# Altium project baseboard.PrjPcb
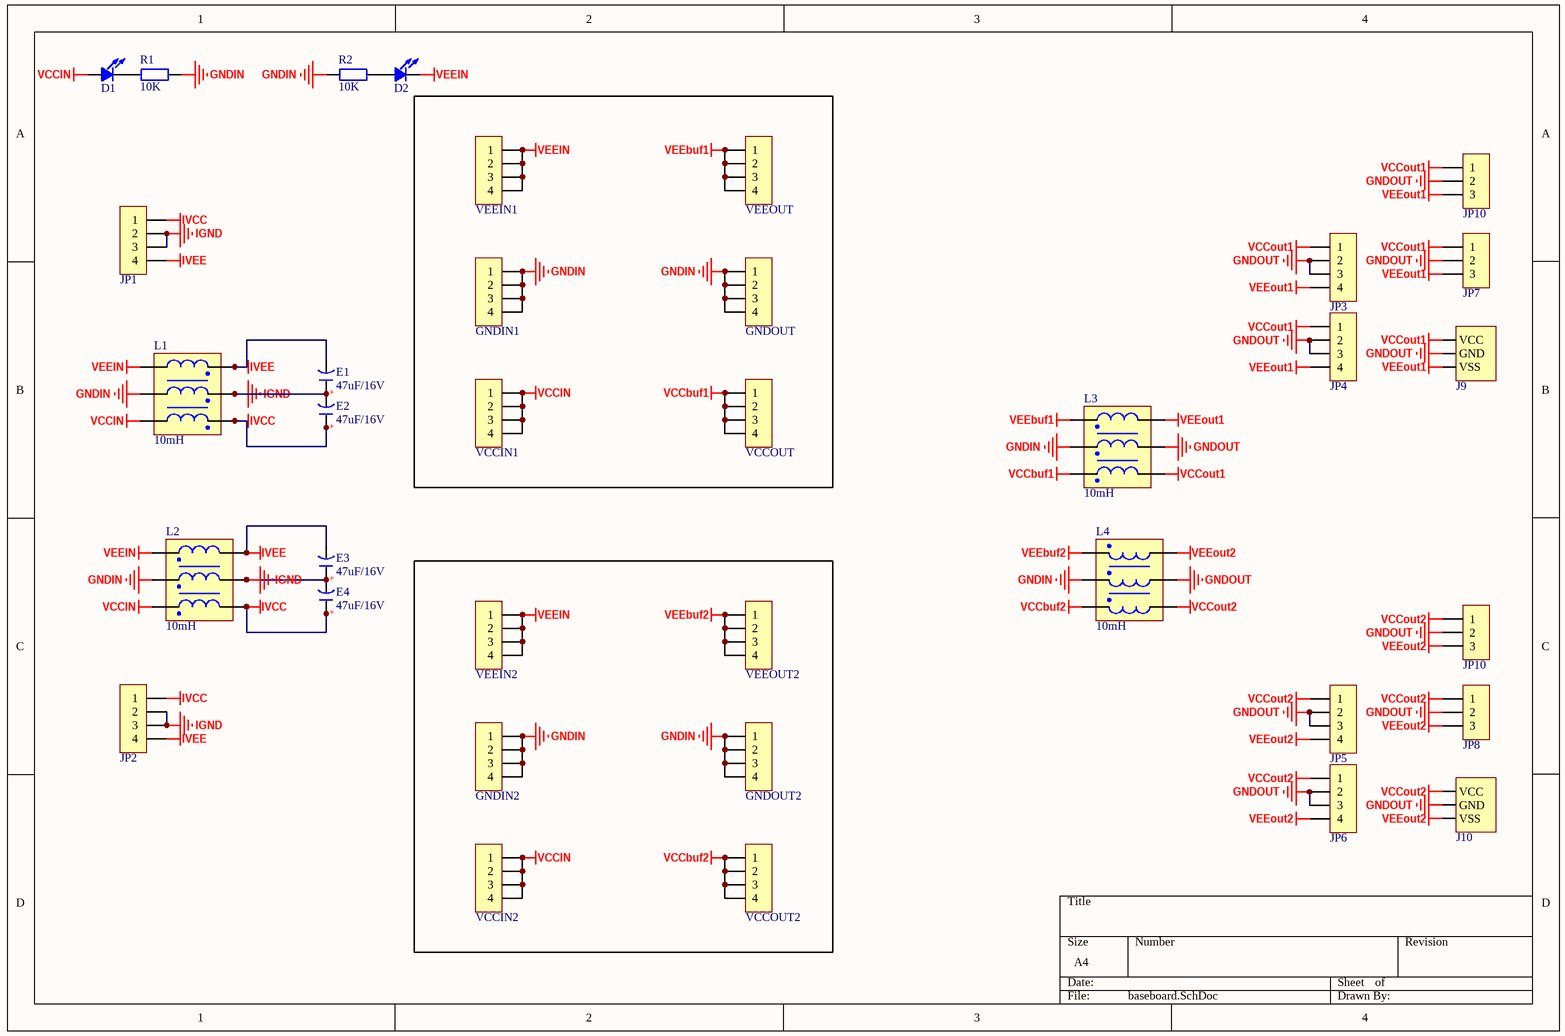
[diagram p0: baseboard.SchDoc]
1 sheet, 36 parts. Net scope: global (net labels, ports and power ports of the same name join across sheets).
Board file: baseboard.PcbDoc

## Sheet baseboard.SchDoc
size A4

### Parts
(Parts that share a designator on the sheet are numbered #1, #2 ... from top to bottom, then left to right.)
D1  LED  [Led-0805_L]  (value not drawn)
D2  LED  [Led-0805_L]  (value not drawn)
E1  47uF/16V  [CAP 2.5*6.3*7]
E2  47uF/16V  [CAP 2.5*6.3*7]
E3  47uF/16V  [CAP 2.5*6.3*7]
E4  47uF/16V  [CAP 2.5*6.3*7]
GNDIN1  HDR-1X4  [HDR2.54-LI-4P]  (value not drawn)
GNDIN2  HDR-1X4  [HDR2.54-LI-4P]  (value not drawn)
GNDOUT  HDR-1X4  [HDR2.54-LI-4P]  (value not drawn)
GNDOUT2  HDR-1X4  [HDR2.54-LI-4P]  (value not drawn)
J9  接线座-3P  [KF128-5.08-3P]  (value not drawn)
J10  接线座-3P  [KF128-5.08-3P]  (value not drawn)
JP1  HDR-1X4  [VH3.96-LI-4P]  (value not drawn)
JP2  HDR-1X4  [VH3.96-LI-4P]  (value not drawn)
JP3  HDR-1X4  [VH3.96-LI-4P]  (value not drawn)
JP4  HDR-1X4  [VH3.96-LI-4P]  (value not drawn)
JP5  HDR-1X4  [VH3.96-LI-4P]  (value not drawn)
JP6  HDR-1X4  [VH3.96-LI-4P]  (value not drawn)
JP7  HDR-1X3  [XH2.54-LI-3P]  (value not drawn)
JP8  HDR-1X3  [XH2.54-LI-3P]  (value not drawn)
JP10#1  HDR-1X3  [XH2.54-LI-3P]  (value not drawn)
JP10#2  HDR-1X3  [XH2.54-LI-3P]  (value not drawn)
L1  10mH  [Inductor CM 3phase-1]
L2  10mH  [Inductor CM 3phase-1]
L3  10mH  [Inductor CM 3phase-1]
L4  10mH  [Inductor CM 3phase-1]
R1  10K  [R 0603_L]
R2  10K  [R 0603_L]
VCCIN1  HDR-1X4  [HDR2.54-LI-4P]  (value not drawn)
VCCIN2  HDR-1X4  [HDR2.54-LI-4P]  (value not drawn)
VCCOUT  HDR-1X4  [HDR2.54-LI-4P]  (value not drawn)
VCCOUT2  HDR-1X4  [HDR2.54-LI-4P]  (value not drawn)
VEEIN1  HDR-1X4  [HDR2.54-LI-4P]  (value not drawn)
VEEIN2  HDR-1X4  [HDR2.54-LI-4P]  (value not drawn)
VEEOUT  HDR-1X4  [HDR2.54-LI-4P]  (value not drawn)
VEEOUT2  HDR-1X4  [HDR2.54-LI-4P]  (value not drawn)

### Nets
GNDIN: GNDIN1.1 GNDIN1.2 GNDIN1.3 GNDIN1.4 GNDIN2.1 GNDIN2.2 GNDIN2.3 GNDIN2.4 GNDOUT.1 GNDOUT.2 GNDOUT.3 GNDOUT.4 GNDOUT2.1 GNDOUT2.2 GNDOUT2.3 GNDOUT2.4 L1.5 L2.2 L3.2 L4.2 R1.1 R2.2
GNDOUT: J9.2(GND) J10.2(GND) JP3.2 JP3.3 JP4.2 JP4.3 JP5.2 JP5.3 JP6.2 JP6.3 JP7.2 JP8.2 JP10#1.2 JP10#2.2 L3.5 L4.5
IGND: E1.1(A) E2.2(K) E3.1(A) E4.2(K) JP1.2 JP1.3 JP2.2 JP2.3 L1.2 L2.5
IVCC: E2.1(A) E4.1(A) JP1.1 JP2.1 L1.1 L2.6
IVEE: E1.2(K) E3.2(K) JP1.4 JP2.4 L1.3 L2.4
VCCbuf1: L3.1 VCCOUT.1 VCCOUT.2 VCCOUT.3 VCCOUT.4
VCCbuf2: L4.3 VCCOUT2.1 VCCOUT2.2 VCCOUT2.3 VCCOUT2.4
VCCIN: D1.1 L1.6 L2.1 VCCIN1.1 VCCIN1.2 VCCIN1.3 VCCIN1.4 VCCIN2.1 VCCIN2.2 VCCIN2.3 VCCIN2.4
VCCout1: J9.1(VCC) JP3.1 JP4.1 JP7.1 JP10#1.1 L3.6
VCCout2: J10.1(VCC) JP5.1 JP6.1 JP8.1 JP10#2.1 L4.4
VEEbuf1: L3.3 VEEOUT.1 VEEOUT.2 VEEOUT.3 VEEOUT.4
VEEbuf2: L4.1 VEEOUT2.1 VEEOUT2.2 VEEOUT2.3 VEEOUT2.4
VEEIN: D2.2 L1.4 L2.3 VEEIN1.1 VEEIN1.2 VEEIN1.3 VEEIN1.4 VEEIN2.1 VEEIN2.2 VEEIN2.3 VEEIN2.4
VEEout1: J9.3(VSS) JP3.4 JP4.4 JP7.3 JP10#1.3 L3.4
VEEout2: J10.3(VSS) JP5.4 JP6.4 JP8.3 JP10#2.3 L4.6
NetD1_2: D1.2 R1.2
NetD2_1: D2.1 R2.1

### Notes on the sheet
- (in symbol C-CAP) +

### Library data of the parts
D1 D2 = LED: 发光二极管
E1-E4 = C-CAP: 直插电解电容; 版权归属: 源创客; BOM名称: 直插电解电容; 学习资源: www.ooocke.com
GNDIN1 GNDIN2 GNDOUT GNDOUT2 VCCIN1 VCCIN2 VCCOUT VCCOUT2 VEEIN1 VEEIN2 VEEOUT VEEOUT2 = Header 4: 4P接插件; 版权归属: 源创客; BOM名称: 4P接插件; 学习资源: www.ooocke.com
JP1-JP6 = Header 4_1: 4P接插件; 版权归属: 源创客; BOM名称: 4P接插件; 学习资源: www.ooocke.com
JP7 JP8 JP10#1 JP10#2 = Header 3: 3P接插件; 版权归属: 源创客; BOM名称: 3P接插件; 学习资源: www.ooocke.com
L1-L4 = Inductor CM 3phase
R1 R2 = R: 贴片电阻; 版权归属: 源创客; BOM名称: 贴片电阻; 学习资源: www.ooocke.com